# EAGLE schematic MicroView (EAGLE 5.11)
REV: 1.0
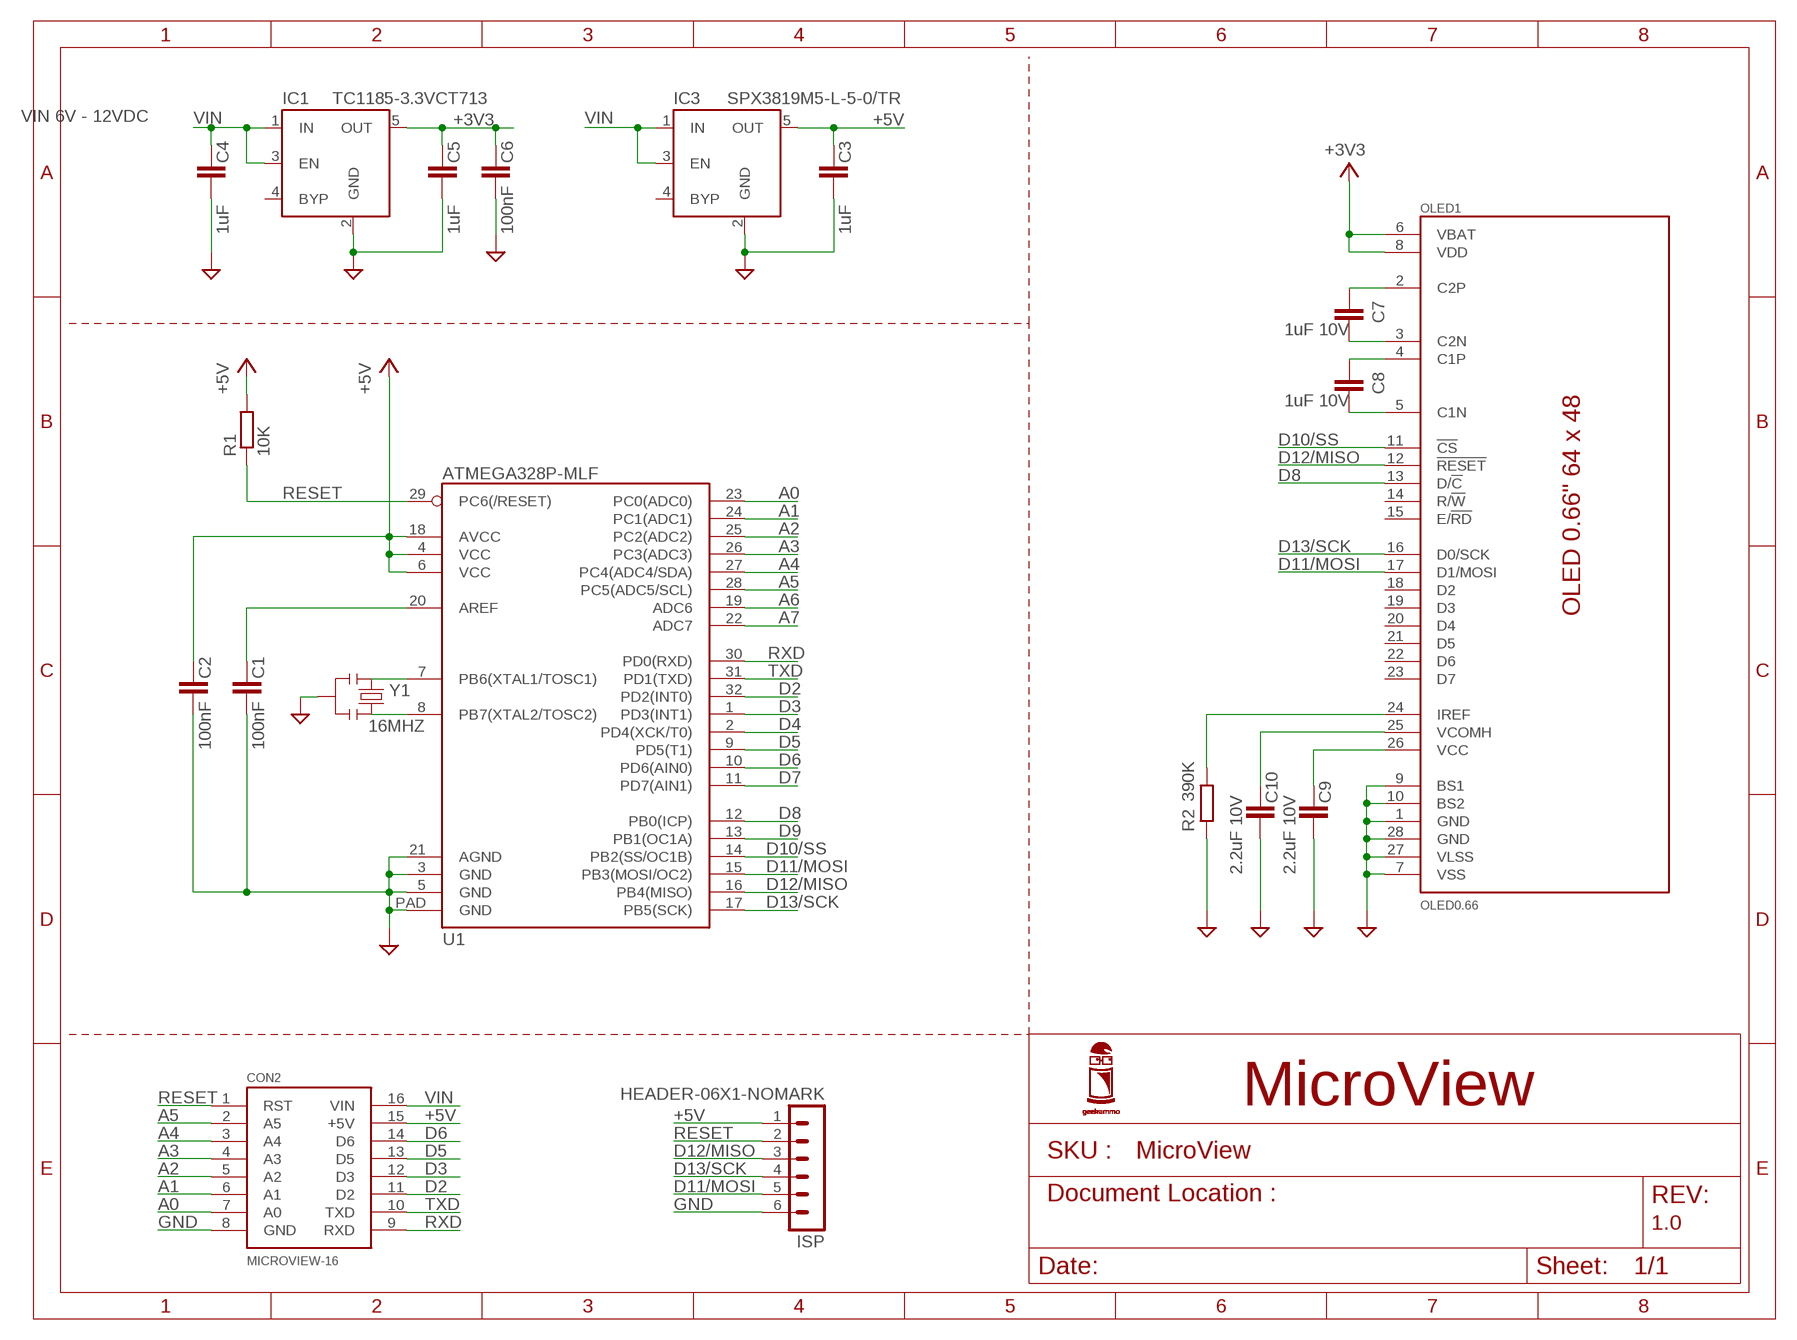
[diagram p0: schematic, sheet 1]

## Parts
C1  100nF  C-EUC0603  [C0603]
C2  100nF  C-EUC0603  [C0603]
C3  1uF  C-EUC0603  [C0603]
C4  1uF  C-EUC0603  [C0603]
C5  1uF  C-EUC0603  [C0603]
C6  100nF  C-EUC0603  [C0603]
C7  1uF 10V  C-EUC0603  [C0603]
C8  1uF 10V  C-EUC0603  [C0603]
C9  2.2uF 10V  C-EUC0603  [C0603]
C10  2.2uF 10V  C-EUC0603  [C0603]
CON2  MICROVIEW-16  [MV-DIP16]
IC1  TC1185-3.3VCT713  MIC5219XX  [SOT23-5]
IC3  SPX3819M5-L-5-0/TR  MIC5219XX  [SOT23-5]
ISP  HEADER-06X1-NOMARK  [06X1-PTH-NOMARK]
OLED1  OLED0.66  [FPC-28-0.65]
R1  10K  R-EU_R0603  [R0603]
R2  390K  R-EU_R0603  [R0603]
U1  ATMEGA328P-MLF  ATMEGA168-MLF32-THERMPAD  [MLF32-THERMPAD]
Y1  16MHZ  CSCTE_V  [CSTCE_V]

## Nets
+3V3: C5.1 C6.1 IC1.5(OUT) OLED1.6(VBAT) OLED1.8(VDD)
+5V: C2.1 C3.1 CON2.15(+5V) IC3.5(OUT) ISP.1 R1.2 U1.4(VCC) U1.6(VCC) U1.18(AVCC)
A0: CON2.7(A0) U1.23(PC0(ADC0))
A1: CON2.6(A1) U1.24(PC1(ADC1))
A2: CON2.5(A2) U1.25(PC2(ADC2))
A3: CON2.4(A3) U1.26(PC3(ADC3))
A4: CON2.3(A4) U1.27(PC4(ADC4/SDA))
A5: CON2.2(A5) U1.28(PC5(ADC5/SCL))
A6: U1.19(ADC6)
A7: U1.22(ADC7)
AREF: C1.1 U1.20(AREF)
D2: CON2.11(D2) U1.32(PD2(INT0))
D3: CON2.12(D3) U1.1(PD3(INT1))
D4: U1.2(PD4(XCK/T0))
D5: CON2.13(D5) U1.9(PD5(T1))
D6: CON2.14(D6) U1.10(PD6(AIN0))
D7: U1.11(PD7(AIN1))
D8: OLED1.13(D/!C!) U1.12(PB0(ICP))
D9: U1.13(PB1(OC1A))
D10/SS: OLED1.11(!CS!) U1.14(PB2(SS/OC1B))
D11/MOSI: ISP.5 OLED1.17(D1/MOSI) U1.15(PB3(MOSI/OC2))
D12/MISO: ISP.3 OLED1.12(!RESET!) U1.16(PB4(MISO))
D13/SCK: ISP.4 OLED1.16(D0/SCK) U1.17(PB5(SCK))
GND: C1.2 C2.2 C3.2 C4.2 C5.2 C6.2 C9.2 C10.2 CON2.8(GND) IC1.2(GND) IC3.2(GND) ISP.6 OLED1.1(GND) OLED1.7(VSS) OLED1.9(BS1) OLED1.10(BS2) OLED1.27(VLSS) OLED1.28(GND) R2.1 U1.3(GND) U1.5(GND) U1.21(AGND) U1.PAD(GND) Y1.2
N$1: U1.7(PB6(XTAL1/TOSC1)) Y1.1
N$2: U1.8(PB7(XTAL2/TOSC2)) Y1.3
N$16: C8.1 OLED1.4(C1P)
N$17: C8.2 OLED1.5(C1N)
N$18: C7.1 OLED1.2(C2P)
N$19: C7.2 OLED1.3(C2N)
N$21: C9.1 OLED1.26(VCC)
N$22: C10.1 OLED1.25(VCOMH)
N$23: OLED1.24(IREF) R2.2
RESET: CON2.1(RST) ISP.2 R1.1 U1.29(PC6(/RESET))
RXD: CON2.9(RXD) U1.30(PD0(RXD))
TXD: CON2.10(TXD) U1.31(PD1(TXD))
VIN: C4.1 CON2.16(VIN) IC1.1(IN) IC1.3(EN) IC3.1(IN) IC3.3(EN)
Unconnected: IC1.4(BYP) IC3.4(BYP) OLED1.14(R/!W!) OLED1.15(E/!RD!) OLED1.18(D2) OLED1.19(D3) OLED1.20(D4) OLED1.21(D5) OLED1.22(D6) OLED1.23(D7)

## Notes on the sheet
- VIN 6V - 12VDC
- MicroView

## Library data of the parts
C1-C10 = resistor:C-EU: CAPACITOR, European symbol
CON2 = GeekAmmo:MICROVIEW-16: MicroView
IC1 IC3 = v-reg-micrel:MIC5219XX: VOLTAGE REGULATOR; OC_FARNELL: unknown; OC_NEWARK: unknown
ISP = GeekAmmo:HEADER-06X1?: 6 x 0.1 inch Header 40x1 0.1inch Male Breakaway header can be used. - 4UCON 00834 <http://www.4uconnector.com/online/SearchPro.asp?FormName=ProSearch&FormAction=search&s_GroupNo=&s_keyword=00834> For female part, if possible use 6 x 1 without breaking.
OLED1 = GeekAmmo:OLED0.66
R1 R2 = resistor:R-EU_: RESISTOR, European symbol
U1 = GeekAmmo:ATMEGA168: ATmega168PA ATmega328P
Y1 = Monkey:CSCTE_V: Ceramic Resonators (CERALOCK) CSTCE_V